# EAGLE design W024X (EAGLE 6.6.0)
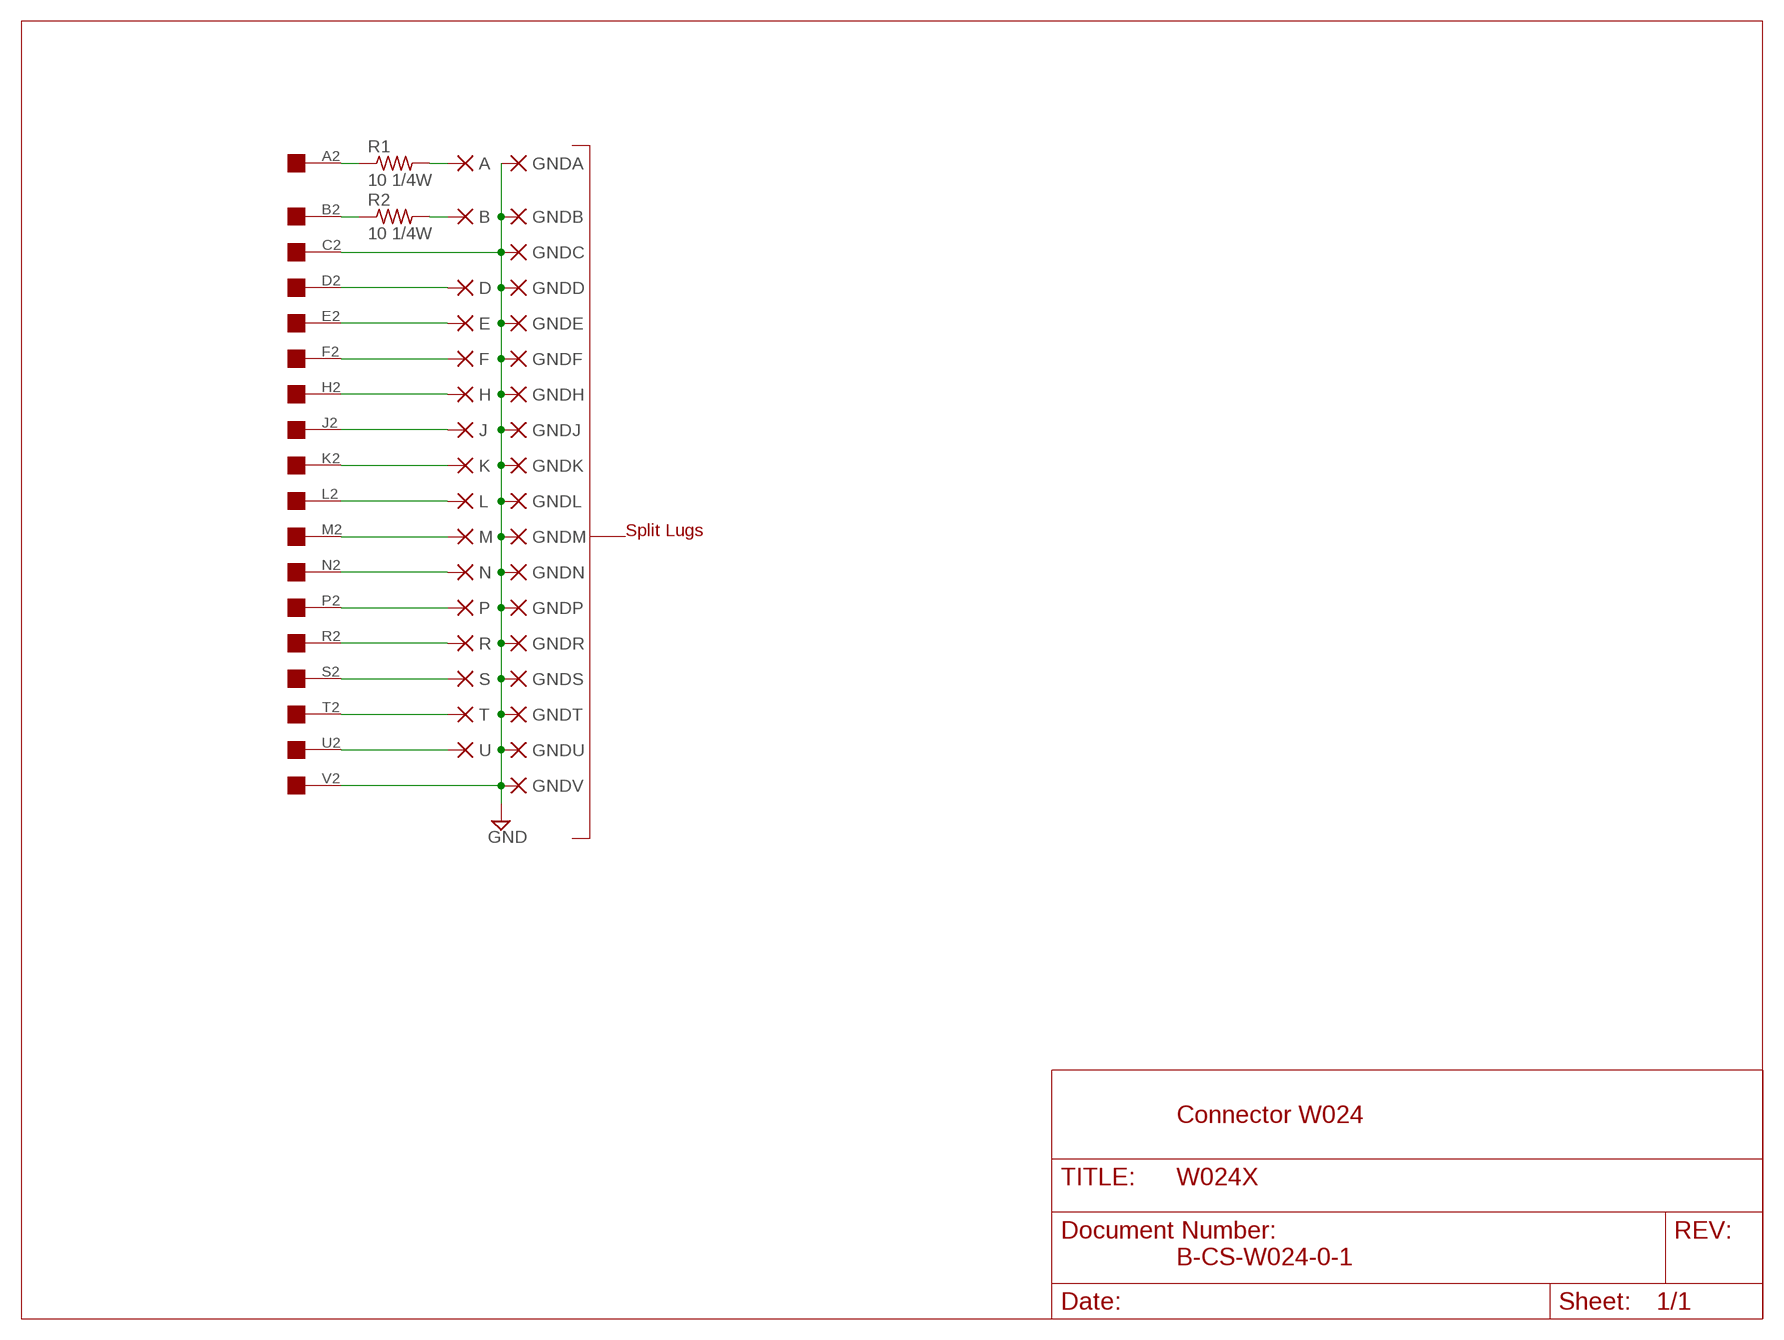
[diagram p0: schematic, sheet 1]

## Parts
A  PAD-0465  [0465]
B  PAD-0465  [0465]
D  PAD-0465  [0465]
E  PAD-0465  [0465]
F  PAD-0465  [0465]
GNDA  PAD-0465  [0465]
GNDB  PAD-0465  [0465]
GNDC  PAD-0465  [0465]
GNDD  PAD-0465  [0465]
GNDE  PAD-0465  [0465]
GNDF  PAD-0465  [0465]
GNDH  PAD-0465  [0465]
GNDJ  PAD-0465  [0465]
GNDK  PAD-0465  [0465]
GNDL  PAD-0465  [0465]
GNDM  PAD-0465  [0465]
GNDN  PAD-0465  [0465]
GNDP  PAD-0465  [0465]
GNDR  PAD-0465  [0465]
GNDS  PAD-0465  [0465]
GNDT  PAD-0465  [0465]
GNDU  PAD-0465  [0465]
GNDV  PAD-0465  [0465]
H  PAD-0465  [0465]
J  PAD-0465  [0465]
K  PAD-0465  [0465]
L  PAD-0465  [0465]
M  PAD-0465  [0465]
N  PAD-0465  [0465]
P  PAD-0465  [0465]
R  PAD-0465  [0465]
R1  10 1/4W  R-US_0207/10  [0207/10]
R2  10 1/4W  R-US_0207/10  [0207/10]
S  PAD-0465  [0465]
T  PAD-0465  [0465]
U  PAD-0465  [0465]
U$2  EDGE-1  [EDGE-CON1]

## Nets
GND [Supply]: GNDA.P$1(P) GNDB.P$1(P) GNDC.P$1(P) GNDD.P$1(P) GNDE.P$1(P) GNDF.P$1(P) GNDH.P$1(P) GNDJ.P$1(P) GNDK.P$1(P) GNDL.P$1(P) GNDM.P$1(P) GNDN.P$1(P) GNDP.P$1(P) GNDR.P$1(P) GNDS.P$1(P) GNDT.P$1(P) GNDU.P$1(P) GNDV.P$1(P) U$2.C2 U$2.V2
N$1 [Supply]: E.P$1(P) U$2.E2
N$2 [Supply]: H.P$1(P) U$2.H2
N$3 [Supply]: K.P$1(P) U$2.K2
N$4 [Supply]: M.P$1(P) U$2.M2
N$5 [Supply]: P.P$1(P) U$2.P2
N$6 [Supply]: S.P$1(P) U$2.S2
N$7 [Supply]: T.P$1(P) U$2.T2
N$9: D.P$1(P) U$2.D2
N$10: R2.1 U$2.B2
N$11: R1.1 U$2.A2
N$12: A.P$1(P) R1.2
N$13: B.P$1(P) R2.2
N$15 [Supply]: F.P$1(P) U$2.F2
N$16 [Supply]: J.P$1(P) U$2.J2
N$17 [Supply]: L.P$1(P) U$2.L2
N$18 [Supply]: N.P$1(P) U$2.N2
N$19 [Supply]: R.P$1(P) U$2.R2
N$20 [Supply]: U$2.U2 U.P$1(P)

## Notes on the sheet
- Split Lugs
- Connector W024
- B-CS-W024-0-1

## Library data of the parts
A B D E F GNDA GNDB GNDC GNDD GNDE GNDF GNDH GNDJ GNDK GNDL GNDM GNDN GNDP GNDR GNDS GNDT GNDU GNDV H J K L M N P R S T U = dec-con:PAD: WIRE PAD Standard US Drill Sizes
R1 R2 = rcl:R-US_: RESISTOR, American symbol
U$2 = dec-con:EDGE-1: Single-Sided DEC Edge Connector -- (side 2)

## Net classes
1 Supply: width 0.813 mm

## Board
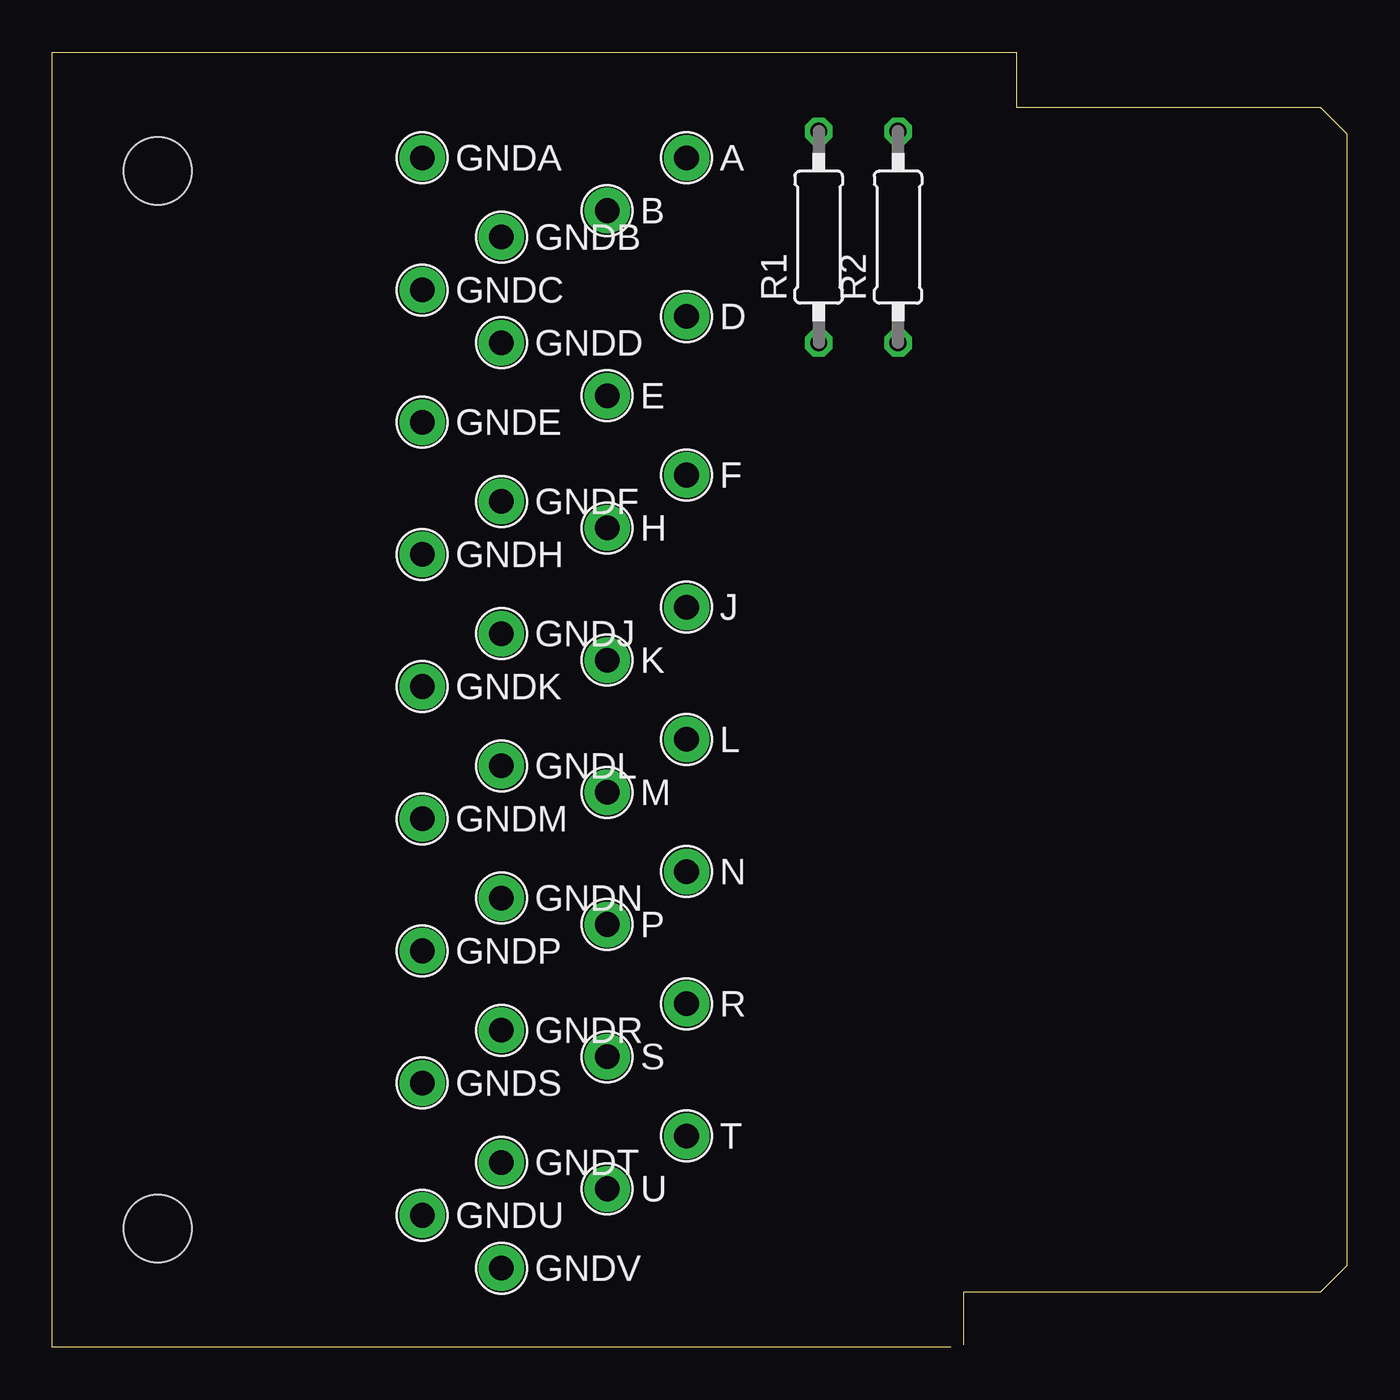
[diagram p1: board, top side]
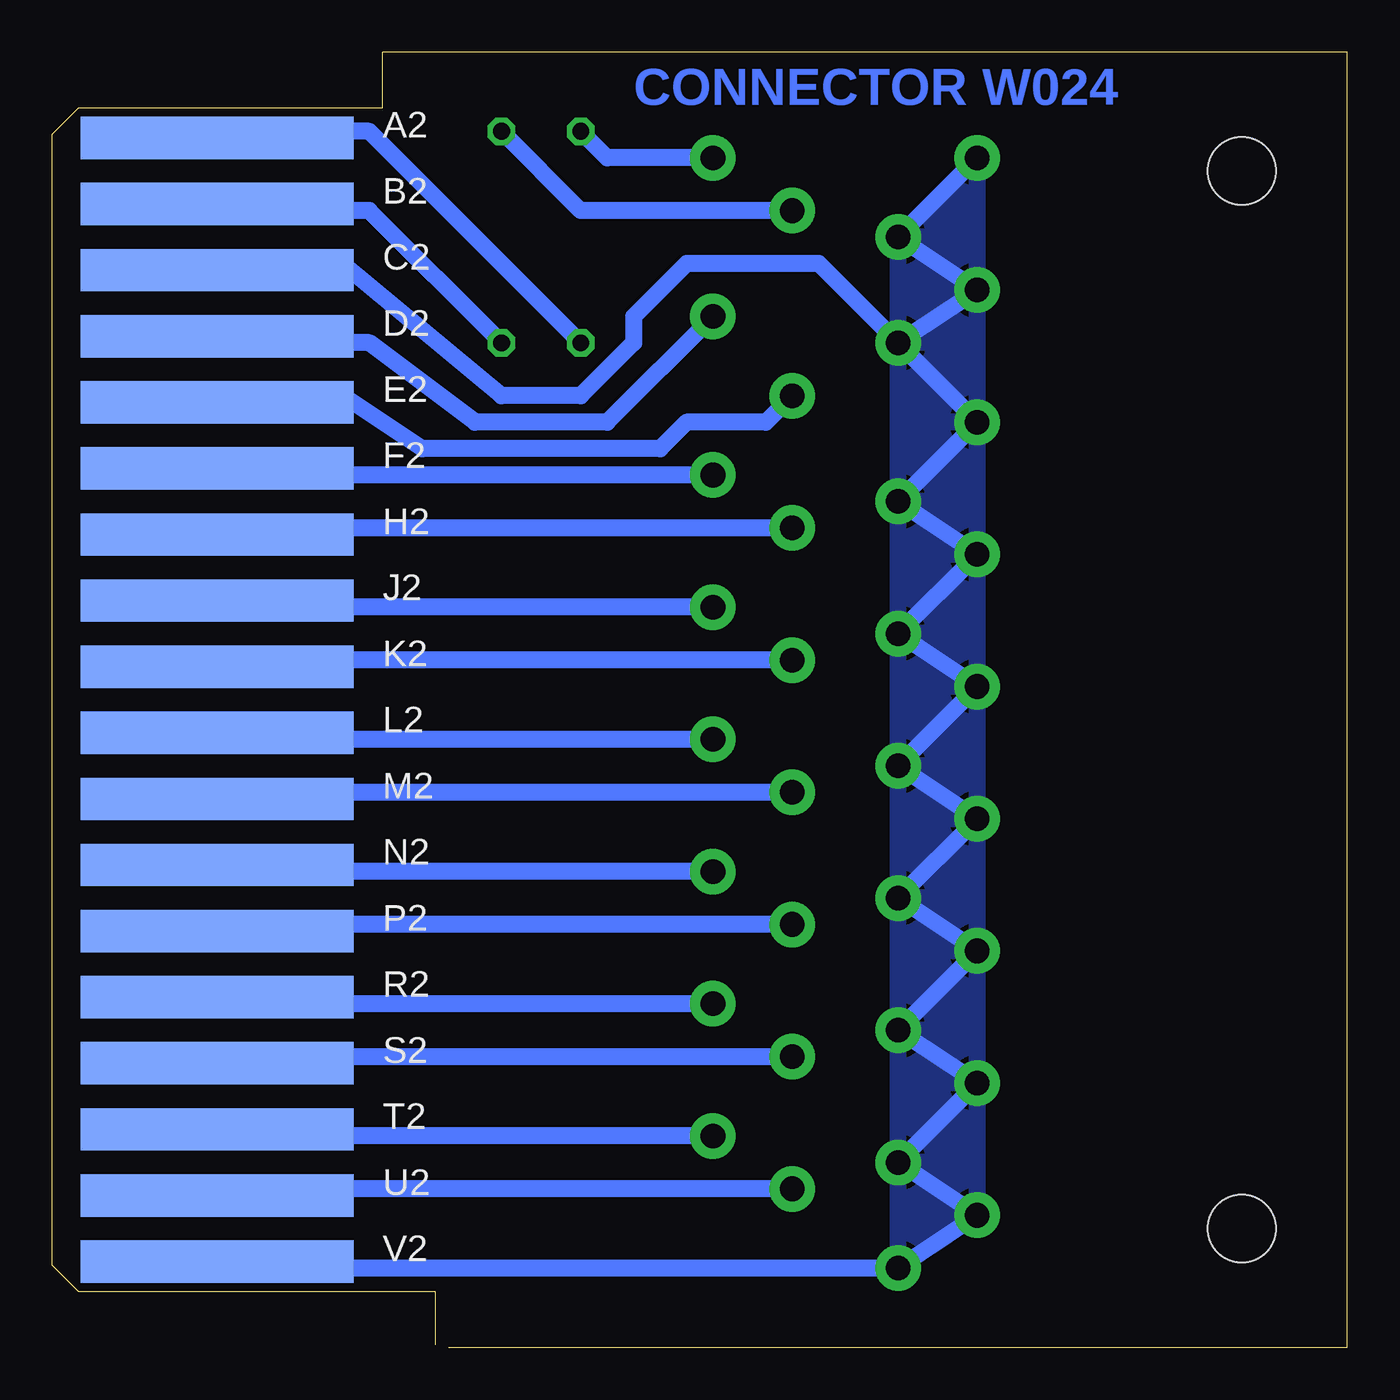
[diagram p2: board, bottom side, seen from below]

Size 62.23 x 62.23 mm. Coordinates in mm from the lower left corner, seen from the top.
Outline: 43.18,0 0,0 0,62.23 46.35,62.23
Copper layers (1+16): Top 0.035mm / dielectric 1.5mm / Bottom 0.035mm
Design rules "16mils": minimum track width 16mil, minimum drill 32mil, track to track 15mil, track to pad 10mil, pad to pad 10mil, via to via 10mil, smd to smd 10mil, copper to edge 13mil, drill to drill 10mil, minimum pad ring 10mil, minimum via ring 8mil, stop-mask expansion 0mil, vias tented up to drill 0mil, thermal gap 10mil
Holes 3.25 mm at 5.08,56.52 5.08,5.71

### Footprints (pad centres in the part's own frame; a part is rotated, then mirrored left to right if it is on the bottom)
0465 = drill 1.181 pad 2.184: P$1 0,0
0207/10 = drill 0.813 octagon: 1 -5.08,0; 2 5.08,0
EDGE-CON1 = smd 13.106 x 2.032 bottom: A2 7.938,4.128; B2 7.938,7.303; C2 7.938,10.477; D2 7.938,13.652; E2 7.938,16.828; F2 7.938,20.003; H2 7.938,23.177; J2 7.938,26.352; K2 7.938,29.527; L2 7.938,32.703; M2 7.938,35.877; N2 7.938,39.053; P2 7.938,42.227; R2 7.938,45.403; S2 7.938,48.578; T2 7.938,51.752; U2 7.938,54.928; V2 7.938,58.102

### Placement (x,y rotation side)
A  30.48,57.15 0 top
B  26.67,54.61 0 top
D  30.48,49.53 0 top
E  26.67,45.72 0 top
F  30.48,41.91 0 top
GNDA  17.78,57.15 0 top
GNDB  21.59,53.34 0 top
GNDC  17.78,50.8 0 top
GNDD  21.59,48.26 0 top
GNDE  17.78,44.45 0 top
GNDF  21.59,40.64 0 top
GNDH  17.78,38.1 0 top
GNDJ  21.59,34.29 0 top
GNDK  17.78,31.75 0 top
GNDL  21.59,27.94 0 top
GNDM  17.78,25.4 0 top
GNDN  21.59,21.59 0 top
GNDP  17.78,19.05 0 top
GNDR  21.59,15.24 0 top
GNDS  17.78,12.7 0 top
GNDT  21.59,8.89 0 top
GNDU  17.78,6.35 0 top
GNDV  21.59,3.81 0 top
H  26.67,39.37 0 top
J  30.48,35.56 0 top
K  26.67,33.02 0 top
L  30.48,29.21 0 top
M  26.67,26.67 0 top
N  30.48,22.86 0 top
P  26.67,20.32 0 top
R  30.48,16.51 0 top
R1  36.83,53.34 90 top
R2  40.64,53.34 90 top
S  26.67,13.97 0 top
T  30.48,10.16 0 top
U  26.67,7.62 0 top
U$2  62.23,62.23 180 top

### Tracks (layer width: path | path; a pad name or v marks a point on that pad's centre or on a via)
GND
  Bottom 0.813: U$2.C2 53.34,52.07 48.26,52.07 40.64,45.72 36.83,45.72 34.29,48.26 34.29,49.53 31.75,52.07 25.4,52.07 GNDD.P$1 | GNDD.P$1 GNDC.P$1 | U$2.V2 53.34,3.81 GNDV.P$1 GNDU.P$1 GNDT.P$1 GNDS.P$1 GNDR.P$1 GNDP.P$1 GNDN.P$1 GNDM.P$1 GNDL.P$1 GNDK.P$1 GNDJ.P$1 GNDH.P$1 GNDF.P$1 GNDE.P$1 GNDD.P$1 | GNDA.P$1 GNDB.P$1 GNDC.P$1 | GNDD.P$1 GNDC.P$1
  pour Bottom: 17.78,57.15 21.59,53.34 21.59,3.81 17.78,6.35
N$1
  Bottom 0.813: U$2.E2 53.34,45.72 48.26,45.72 44.45,43.18 33.02,43.18 31.75,44.45 27.94,44.45 E.P$1
N$2
  Bottom 0.813: U$2.H2 53.34,39.37 H.P$1
N$3
  Bottom 0.813: U$2.K2 53.34,33.02 K.P$1
N$4
  Bottom 0.813: U$2.M2 53.34,26.67 M.P$1
N$5
  Bottom 0.813: U$2.P2 53.67,19.99 53.34,20.32 P.P$1
N$6
  Bottom 0.813: U$2.S2 53.34,13.97 S.P$1
N$7
  Bottom 0.813: U$2.T2 53.34,10.16 T.P$1
N$9
  Bottom 0.813: U$2.D2 53.34,48.26 48.26,48.26 46.99,48.26 41.91,44.45 35.56,44.45 D.P$1
N$10
  Bottom 0.813: U$2.B2 52.36,54.9 52.07,54.61 46.99,54.61 R2.1
N$11
  Bottom 0.813: U$2.A2 53.72,58.04 53.34,58.42 46.99,58.42 R1.1
N$12
  Bottom 0.813: A.P$1 35.56,57.15 R1.2
N$13
  Bottom 0.813: B.P$1 36.83,54.61 R2.2
N$15
  Bottom 0.813: U$2.F2 53.34,41.91 F.P$1
N$16
  Bottom 0.813: U$2.J2 53.34,35.56 J.P$1
N$17
  Bottom 0.813: U$2.L2 53.34,29.21 L.P$1
N$18
  Bottom 0.813: U$2.N2 53.34,22.86 N.P$1
N$19
  Bottom 0.813: U$2.R2 53.34,16.51 R.P$1
N$20
  Bottom 0.813: U$2.U2 53.34,7.62 U.P$1

### Text on the board
Bottom: CONNECTOR W024